# Altium schematic sheet Slot_Detectors.SchDoc
size A
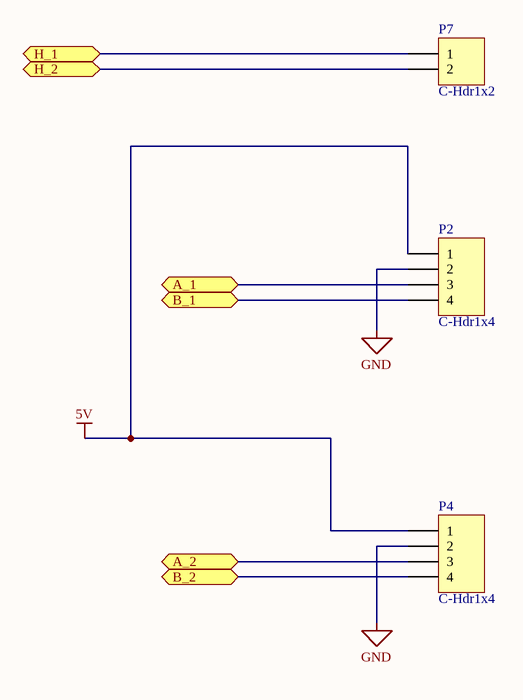
[diagram p0: Slot_Detectors.SchDoc]

## Parts
P2  C-Hdr1x4  [HDR1X4_LGE1.0]
P4  C-Hdr1x4  [HDR1X4_LGE1.0]
P7  C-Hdr1x2  [HDR1X2_LGE1.0]

## Ports
A_1 (bidir), A_2 (bidir), B_1 (bidir), B_2 (bidir), H_1 (bidir), H_2 (bidir)

## Nets
5V: P2.1 P4.1
GND: P2.2 P4.2
A_1: P2.3 ; port A_1
A_2: P4.3 ; port A_2
B_1: P2.4 ; port B_1
B_2: P4.4 ; port B_2
H_1: P7.1 ; port H_1
H_2: P7.2 ; port H_2

## Library data of the parts
P2 P4 = C-Hdr1x4: Header, 4-Pin; LatestRevisionDate: 17-Jul-2002; LatestRevisionNote: Re-released for DXP Platform.; Publisher: Altium Limited
P7 = C-Hdr1x2: Header, 2-Pin; LatestRevisionDate: 17-Jul-2002; LatestRevisionNote: Re-released for DXP Platform.; Publisher: Altium Limited